# Altium project 2_Smoke_detector.PrjPcb (part 2 of 6)
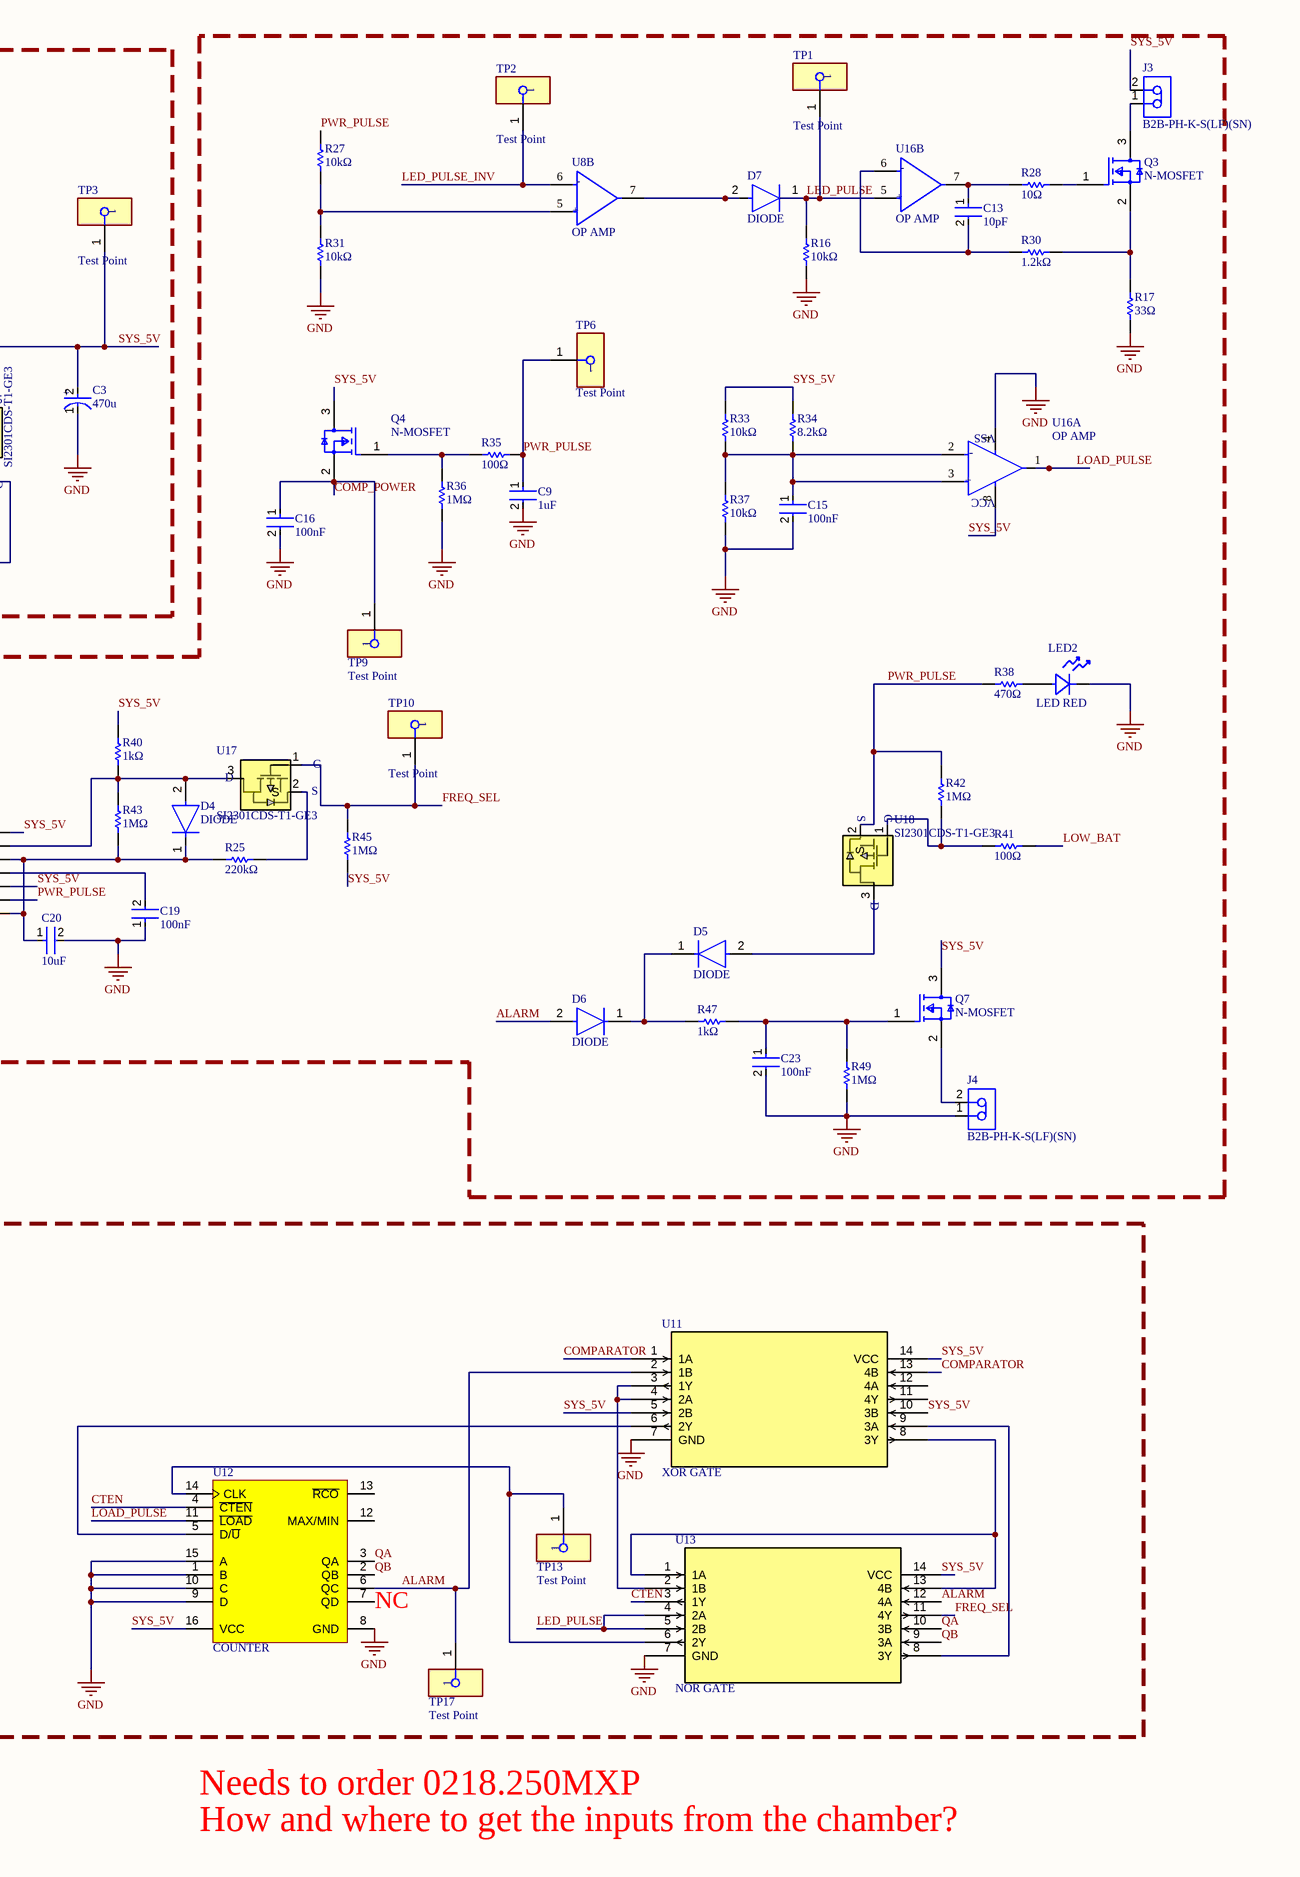
[diagram p2: 2_Smoke_detector.SchDoc, right]

## Sheet 2_Smoke_detector.SchDoc (continued)
### Library data of the parts
C1 = EEEFT1C101AR: CAP ALUM 100uF 20% 16V SMD; Life (Hours): 2000Hour; Ripple Current: 240mA; Leakage Current: 16uA; Lead Diameter: 0.65mm; ESR (Equivalent Series Resistance): 360mR; Capacitance: 100uF; Voltage Rating: 16V; Lead Pitch: 1.5mm; RoHS Compliant: Yes; Mount: Surface Mount; Tolerance: 20%; Contact Plating: Tin; Length: 5.8mm; Voltage: 16V; REACH SVHC: No SVHC; Max Operating Temperature: 105°C; Series: FT; Min Operating Temperature: -55°C; Diameter: 5mm; Case/Package: Radial; Radiation Hardening: No; Height - Seated (Max): 0.24inch; Construction: Cylindrical; Packaging: Tape and Reel; Voltage Rating (DC): 16V; Termination: SMD/SMT; Package Quantity: 1000; Ripple Current (AC): 240mA; Height: 5.8mm; LCSC Part Number: C336792
C2 C8 = CL21B104KBCNNNC: CAP CER 0.1uF 50V X7R 0805; Tolerance: 10%; Material: Ceramic; Capacitance: 100nF; Depth: 1.25mm; Height: 0.85mm; Width: 0.049inch; Case Code (Metric): 2012; Case Code (Imperial): 0805; Thickness: 0.037inch; Min Operating Temperature: -55°C; Contact Plating: Tin; Length: 2mm; Mount: Surface Mount; Voltage Rating (DC): 50V; Lead Free: Lead Free; Dielectric: X7R; Radiation Hardening: No; Voltage Rating: 50V; Case/Package: 0805; Packaging: Tape and Reel; Max Operating Temperature: 125°C; Voltage: 50V; LCSC Part Number: C1711
C3 = EEEFK1A471P: CAP ALUM 470uF ±20% 10V SMD; Manufacturer: Panasonic; Manufacturer Lifecycle Status: ACTIVE; Part Series: FK; Value: 470µF; Dielectric Material: Aluminium; Dissipation Factor: 19%; ESR (Equivalent Series Resistance): 160mΩ; Leakage Current: 47µA; Life (Hours): 2000hours; Ripple Current: 600mA; Supplier: Avnet; Supplier Part Number: EEE-FK1A471P; Manufacturer Part Number: EEEFK1A471P; RoHS: Compliant; Category: Aluminum Electrolytic Capacitors; Stock: 4000; Pricing: 500=0.28647, 1000=0.27558, 2000=0.26534, 4000=0.25696, 8000=0.24826 (USD); Case/Package: 3333; Country of Origin: Japan, Malaysia; Diameter: 8mm; Export Control Classification Number (ECCN) Code: EAR99; Height: 10.2mm; Height - Seated (Max): 10.2108mm; Harmonized Tariff Schedule (HTS) Code: 8532.22.00.20; Impedance: 160mΩ; Introduction Date: 2004-08-25; Lead Free: Lead Free; Length: 10.2mm; Lifecycle Status: Production; Max Operating Temperature: 105°C; Min Operating Temperature: -55°C; Mounting Technology: Surface Mount; Pins: 2; Number of Terminals: 2; Packaging: Cut Tape; Radiation Hardening: No; Ratings: AEC-Q200; REACH SVHC: Unaffected; Ripple Current (AC): 600mA; Schedule B: 8532220020, 8532220020|8532220020|8532220020|8532220020|8532220020; Termination: SMD/SMT; Tolerance: 20%; Voltage: 10V; Voltage Rating: 10V; Voltage Rating (AC): 10V; Voltage Rating (DC): 10V; Width: 8.3mm; ComponentLink1URL: https://datasheet.octopart.com:443/EEEFK1A471P-Panasonic-datasheet-169278531.pdf?src-supplier=IHS; ComponentLink1Description: https://datasheet.octopart.com:443/EEEFK1A471P-Panasonic-datasheet-169278531.pdf?src-supplier=IHS; ComponentLink2URL: https://datasheet.octopart.com:443/EEEFK1A471P-Panasonic-datasheet-62287436.pdf?src-supplier=Future+Electronics; ComponentLink2Description: https://datasheet.octopart.com:443/EEEFK1A471P-Panasonic-datasheet-62287436.pdf?src-supplier=Future+Electronics; ComponentLink3URL: https://datasheet.octopart.com:443/EEEFK1A471P-Panasonic-datasheet-8854493.pdf?src-supplier=Future+Electronics; ComponentLink3Description: https://datasheet.octopart.com:443/EEEFK1A471P-Panasonic-datasheet-8854493.pdf?src-supplier=Future+Electronics; ComponentLink4URL: https://datasheet.octopart.com:443/EEEFK1A471P-Panasonic-datasheet-8711795.pdf?src-supplier=Future+Electronics; ComponentLink4Description: https://datasheet.octopart.com:443/EEEFK1A471P-Panasonic-datasheet-8711795.pdf?src-supplier=Future+Electronics; ComponentLink5URL: https://datasheet.octopart.com:443/EEEFK1A471P-Panasonic-datasheet-5313801.pdf?src-supplier=Future+Electronics; ComponentLink5Description: https://datasheet.octopart.com:443/EEEFK1A471P-Panasonic-datasheet-5313801.pdf?src-supplier=Future+Electronics; ComponentLink6URL: https://datasheet.octopart.com:443/EEEFK1A471P-Panasonic-datasheet-61627622.pdf?src-supplier=Newark; ComponentLink6Description: https://datasheet.octopart.com:443/EEEFK1A471P-Panasonic-datasheet-61627622.pdf?src-supplier=Newark; ComponentLink7URL: https://datasheet.octopart.com:443/EEEFK1A471P-Panasonic-datasheet-8161.pdf?src-supplier=Newark; ComponentLink7Description: https://datasheet.octopart.com:443/EEEFK1A471P-Panasonic-datasheet-8161.pdf?src-supplier=Newark; ComponentLink8URL: https://datasheet.octopart.com:443/EEEFK1A471P-Panasonic-datasheet-8852369.pdf?src-supplier=Newark; ComponentLink8Description: https://datasheet.octopart.com:443/EEEFK1A471P-Panasonic-datasheet-8852369.pdf?src-supplier=Newark; ComponentLink9URL: https://datasheet.octopart.com:443/EEEFK1A471P-Panasonic-datasheet-8712906.pdf?src-supplier=Newark; ComponentLink9Description: https://datasheet.octopart.com:443/EEEFK1A471P-Panasonic-datasheet-8712906.pdf?src-supplier=Newark; ComponentLink10URL: https://datasheet.octopart.com:443/EEEFK1A471P-Panasonic-datasheet-13278598.pdf?src-supplier=Newark; ComponentLink10Description: https://datasheet.octopart.com:443/EEEFK1A471P-Panasonic-datasheet-13278598.pdf?src-supplier=Newark; ComponentLink11URL: https://datasheet.octopart.com:443/EEE-FK1A471P-Panasonic-datasheet-159140467.pdf?src-supplier=Newark; ComponentLink11Description: https://datasheet.octopart.com:443/EEE-FK1A471P-Panasonic-datasheet-159140467.pdf?src-supplier=Newark; ComponentLink12URL: https://datasheet.octopart.com:443/EEE-FK1A471P-Panasonic-datasheet-22087609.pdf?src-supplier=Newark; ComponentLink12Description: https://datasheet.octopart.com:443/EEE-FK1A471P-Panasonic-datasheet-22087609.pdf?src-supplier=Newark; ComponentLink13URL: https://datasheet.octopart.com:443/EEE-FK1A471P-Panasonic-datasheet-150469824.pdf?src-supplier=JRH+Electronics; ComponentLink13Description: https://datasheet.octopart.com:443/EEE-FK1A471P-Panasonic-datasheet-150469824.pdf?src-supplier=JRH+Electronics; ComponentLink14URL: https://datasheet.octopart.com:443/EEEFK1A471P-Panasonic-datasheet-13266987.pdf?src-supplier=RS+(Formerly+Allied+Electronics); ComponentLink14Description: https://datasheet.octopart.com:443/EEEFK1A471P-Panasonic-datasheet-13266987.pdf?src-supplier=RS+(Formerly+Allied+Electronics); ComponentLink15URL: https://datasheet.octopart.com:443/EEE-FK1A471P-Panasonic-datasheet-11546739.pdf?src-supplier=Electro+Sonic; ComponentLink15Description: https://datasheet.octopart.com:443/EEE-FK1A471P-Panasonic-datasheet-11546739.pdf?src-supplier=Electro+Sonic; ComponentLink16URL: https://sigma.octopart.com:443/150570760/technical_drawing/Panasonic-EEEFK1A471P.pdf?src-supplier=Panasonic+SCT; ComponentLink16Description: https://sigma.octopart.com:443/150570760/technical_drawing/Panasonic-EEEFK1A471P.pdf?src-supplier=Panasonic+SCT; ComponentLink17URL: https://datasheet.octopart.com:443/EEEFK1A471P-Panasonic-datasheet-136531309.pdf?src-supplier=TME; ComponentLink17Description: https://datasheet.octopart.com:443/EEEFK1A471P-Panasonic-datasheet-136531309.pdf?src-supplier=TME; ComponentLink18URL: https://datasheet.octopart.com:443/EEEFK1A471P-Panasonic-datasheet-136348055.pdf?src-supplier=TME; ComponentLink18Description: https://datasheet.octopart.com:443/EEEFK1A471P-Panasonic-datasheet-136348055.pdf?src-supplier=TME; ComponentLink19URL: https://datasheet.octopart.com:443/EEEFK1A471P-Panasonic-datasheet-7555708.pdf?src-supplier=Farnell; ComponentLink19Description: https://datasheet.octopart.com:443/EEEFK1A471P-Panasonic-datasheet-7555708.pdf?src-supplier=Farnell; ComponentLink20URL: https://datasheet.octopart.com:443/EEEFK1A471P-Panasonic-datasheet-5318435.pdf?src-supplier=Farnell; ComponentLink20Description: https://datasheet.octopart.com:443/EEEFK1A471P-Panasonic-datasheet-5318435.pdf?src-supplier=Farnell; ComponentLink21URL: https://datasheet.octopart.com:443/EEEFK1A471P-Panasonic-datasheet-5316599.pdf?src-supplier=Farnell; ComponentLink21Description: https://datasheet.octopart.com:443/EEEFK1A471P-Panasonic-datasheet-5316599.pdf?src-supplier=Farnell; ComponentLink22URL: https://datasheet.octopart.com:443/EEEFK1A471P-Panasonic-datasheet-5390910.pdf?src-supplier=Farnell; ComponentLink22Description: https://datasheet.octopart.com:443/EEEFK1A471P-Panasonic-datasheet-5390910.pdf?src-supplier=Farnell; ComponentLink23URL: https://datasheet.octopart.com:443/EEEFK1A471P-Panasonic-datasheet-7550061.pdf?src-supplier=Farnell; ComponentLink23Description: https://datasheet.octopart.com:443/EEEFK1A471P-Panasonic-datasheet-7550061.pdf?src-supplier=Farnell; ComponentLink24URL: https://datasheet.octopart.com:443/EEEFK1A471P-Panasonic-datasheet-1770.pdf?src-supplier=Farnell; ComponentLink24Description: https://datasheet.octopart.com:443/EEEFK1A471P-Panasonic-datasheet-1770.pdf?src-supplier=Farnell; ComponentLink25URL: https://datasheet.octopart.com:443/EEEFK1A471P-Panasonic-datasheet-1290.pdf?src-supplier=Farnell; ComponentLink25Description: https://datasheet.octopart.com:443/EEEFK1A471P-Panasonic-datasheet-1290.pdf?src-supplier=Farnell; ComponentLink26URL: https://datasheet.octopart.com:443/EEEFK1A471P-Panasonic-datasheet-2601.pdf?src-supplier=Farnell; ComponentLink26Description: https://datasheet.octopart.com:443/EEEFK1A471P-Panasonic-datasheet-2601.pdf?src-supplier=Farnell; ComponentLink27URL: https://datasheet.octopart.com:443/EEEFK1A471P-Panasonic-datasheet-122249.pdf?src-supplier=Farnell; ComponentLink27Description: https://datasheet.octopart.com:443/EEEFK1A471P-Panasonic-datasheet-122249.pdf?src-supplier=Farnell; ComponentLink28URL: https://datasheet.octopart.com:443/EEEFK1A471P-Panasonic-datasheet-4056.pdf?src-supplier=Farnell; ComponentLink28Description: https://datasheet.octopart.com:443/EEEFK1A471P-Panasonic-datasheet-4056.pdf?src-supplier=Farnell; LCSC Part Number: C178530
C4 = CC0805KRX7R6BB224: CAP CER 0.22uF 10V X7R 0805; Manufacturer: Yageo Group; Manufacturer Package Identifier: CC0805-0.85; Value: 220nF; Dielectric Material: Ceramic; Dissipation Factor: 5%; Insulation Resistance: 10GΩ; Tolerance: 10%; Supplier: DigiKey; Supplier Part Number: 311-4309-1-ND; Manufacturer Part Number: CC0805KRX7R6BB224; RoHS: Compliant; Category: Ceramic Capacitors; Stock: 33422; Pricing: 1=0.19, 10=0.109, 50=0.0768, 100=0.0669, 500=0.05016 (USD); Case/Package: 0805; Case Code (Imperial): 0805; Case Code (Metric): 2012; China RoHS: Compliant; Composition: Ceramic; Country of Origin: Mainland China, Taiwan; Depth: 1.25mm; Dielectric: X7R; Export Control Classification Number (ECCN) Code: EAR99; Halogen Free: Halogen Free; Height: 850µm; Harmonized Tariff Schedule (HTS) Code: 8532.24.00.20; Introduction Date: 2011-01-31; Lead Free: Lead Free; Length: 2mm; Lifecycle Status: Production; Material: Ceramic; Max Operating Temperature: 125°C; Min Operating Temperature: -55°C; Mounting Technology: Surface Mount; Number of Terminals: 2; Packaging: Tape and Reel; REACH SVHC: Unaffected; Termination: SMD/SMT; Thickness: 939.8µm; Voltage Rating: 10V; Voltage Rating (DC): 10V; Weight: 5.499807mg; Width: 1.25mm; ComponentLink1URL: https://datasheet.octopart.com:443/CC0805KRX7R6BB224-Yageo-datasheet-177165144.pdf?src-supplier=IHS; ComponentLink1Description: https://datasheet.octopart.com:443/CC0805KRX7R6BB224-Yageo-datasheet-177165144.pdf?src-supplier=IHS; ComponentLink2URL: https://datasheet.octopart.com:443/CC0805KRX7R6BB224-Yageo-datasheet-78855689.pdf?src-supplier=Upverter; ComponentLink2Description: https://datasheet.octopart.com:443/CC0805KRX7R6BB224-Yageo-datasheet-78855689.pdf?src-supplier=Upverter; ComponentLink3URL: https://datasheet.octopart.com/CC0805KRX7R6BB224-Yageo-datasheet-10883670.pdf; ComponentLink3Description: https://datasheet.octopart.com/CC0805KRX7R6BB224-Yageo-datasheet-10883670.pdf; ComponentLink4URL: https://datasheet.octopart.com:443/CC0805KRX7R6BB224-Yageo-Group-datasheet-184163374.pdf?src-supplier=LCSC; ComponentLink4Description: https://datasheet.octopart.com:443/CC0805KRX7R6BB224-Yageo-Group-datasheet-184163374.pdf?src-supplier=LCSC; ComponentLink5URL: https://datasheet.octopart.com:443/CC0805KRX7R6BB224-Yageo-datasheet-166511530.pdf?src-supplier=Future+Electronics; ComponentLink5Description: https://datasheet.octopart.com:443/CC0805KRX7R6BB224-Yageo-datasheet-166511530.pdf?src-supplier=Future+Electronics; ComponentLink6URL: https://datasheet.octopart.com:443/CC0805KRX7R6BB224-Yageo-datasheet-137700082.pdf?src-supplier=Future+Electronics; ComponentLink6Description: https://datasheet.octopart.com:443/CC0805KRX7R6BB224-Yageo-datasheet-137700082.pdf?src-supplier=Future+Electronics; ComponentLink7URL: https://datasheet.octopart.com:443/CC0805KRX7R6BB224-Yageo-datasheet-137700084.pdf?src-supplier=Future+Electronics; ComponentLink7Description: https://datasheet.octopart.com:443/CC0805KRX7R6BB224-Yageo-datasheet-137700084.pdf?src-supplier=Future+Electronics; ComponentLink8URL: https://datasheet.octopart.com:443/CC0805KRX7R6BB224-Yageo-datasheet-27626582.pdf?src-supplier=Future+Electronics; ComponentLink8Description: https://datasheet.octopart.com:443/CC0805KRX7R6BB224-Yageo-datasheet-27626582.pdf?src-supplier=Future+Electronics; ComponentLink9URL: https://datasheet.octopart.com:443/CC0805KRX7R6BB224-Yageo-datasheet-15895757.pdf?src-supplier=Future+Electronics; ComponentLink9Description: https://datasheet.octopart.com:443/CC0805KRX7R6BB224-Yageo-datasheet-15895757.pdf?src-supplier=Future+Electronics; ComponentLink10URL: https://datasheet.octopart.com:443/CC0805KRX7R6BB224-Yageo-datasheet-12526321.pdf?src-supplier=Future+Electronics; ComponentLink10Description: https://datasheet.octopart.com:443/CC0805KRX7R6BB224-Yageo-datasheet-12526321.pdf?src-supplier=Future+Electronics; ComponentLink11URL: https://datasheet.octopart.com:443/CC0805KRX7R6BB224-Yageo-Group-datasheet-165992755.pdf?src-supplier=ODG+(Origin+Data+Global); ComponentLink11Description: https://datasheet.octopart.com:443/CC0805KRX7R6BB224-Yageo-Group-datasheet-165992755.pdf?src-supplier=ODG+(Origin+Data+Global); ComponentLink12URL: http://sigma.octopart.com:80/conflict_mineral_statement/Yageo-company-3.pdf?src-supplier=Compliance+Statements; ComponentLink12Description: http://sigma.octopart.com:80/conflict_mineral_statement/Yageo-company-3.pdf?src-supplier=Compliance+Statements; ComponentLink13URL: http://sigma.octopart.com:80/rohs_statement/Yageo-company-2.pdf?src-supplier=Compliance+Statements; ComponentLink13Description: http://sigma.octopart.com:80/rohs_statement/Yageo-company-2.pdf?src-supplier=Compliance+Statements; LCSC Part Number: C520019
C5 C6 = GRM21BR61A476ME15L: CAP CER 47uF 10V X5R 0805; Manufacturer: Murata; Manufacturer Lifecycle Status: IN PRODUCTION; Value: 47µF; Dielectric Material: Ceramic; Dissipation Factor: 0.035%; Tolerance: 20%; Supplier: Future Electronics; Supplier Part Number: GRM21BR61A476ME15L; Manufacturer Part Number: GRM21BR61A476ME15L; RoHS: Compliant; Category: Ceramic Capacitors; Stock: 548000; Pricing: 3000=0.715 (USD); Case/Package: 0805; Case Code (Imperial): 0805; Case Code (Metric): 2012; Country of Origin: Philippines; Depth: 1.25mm; Dielectric: X5R; Export Control Classification Number (ECCN) Code: EAR99; Height: 1.25mm; Harmonized Tariff Schedule (HTS) Code: 8532.24.00.20; Introduction Date: 2013-11-20; Lead Free: Lead Free; Length: 2mm; Lifecycle Status: Production; Material: Ceramic; Max Operating Temperature: 85°C; Min Operating Temperature: -55°C; Mounting Technology: Surface Mount; Number of Terminals: 2; Packaging: Cut Tape; REACH SVHC: Unaffected; Schedule B: 8532240020, 8532240020|8532240020, 8532240020|8532240020|8532240020, 8532240020|8532240020|8532240020|8532240020; Termination: SMD/SMT; Thickness: 1.25mm; Voltage: 10V; Voltage Rating: 10V; Voltage Rating (DC): 10V; Width: 1.25mm; ComponentLink1URL: https://datasheet.octopart.com:443/GRM21BR61A476ME15L-Murata-datasheet-22122223.pdf?src-supplier=Upverter; ComponentLink1Description: https://datasheet.octopart.com:443/GRM21BR61A476ME15L-Murata-datasheet-22122223.pdf?src-supplier=Upverter; ComponentLink2URL: https://datasheet.octopart.com:443/GRM21BR61A476ME15L-Murata-datasheet-66077109.pdf?src-supplier=element14+APAC; ComponentLink2Description: https://datasheet.octopart.com:443/GRM21BR61A476ME15L-Murata-datasheet-66077109.pdf?src-supplier=element14+APAC; ComponentLink3URL: https://datasheet.octopart.com:443/GRM21BR61A476ME15L-Murata-datasheet-141278181.pdf?src-supplier=Geoflip; ComponentLink3Description: https://datasheet.octopart.com:443/GRM21BR61A476ME15L-Murata-datasheet-141278181.pdf?src-supplier=Geoflip; ComponentLink4URL: https://datasheet.octopart.com:443/GRM21BR61A476ME15L-Murata-datasheet-165579666.pdf?src-supplier=TME; ComponentLink4Description: https://datasheet.octopart.com:443/GRM21BR61A476ME15L-Murata-datasheet-165579666.pdf?src-supplier=TME; ComponentLink5URL: https://datasheet.octopart.com:443/GRM21BR61A476ME15L-Murata-datasheet-59876780.pdf?src-supplier=TME; ComponentLink5Description: https://datasheet.octopart.com:443/GRM21BR61A476ME15L-Murata-datasheet-59876780.pdf?src-supplier=TME; ComponentLink6URL: https://datasheet.octopart.com:443/GRM21BR61A476ME15L-Murata-datasheet-140707527.pdf?src-supplier=Ciiva; ComponentLink6Description: https://datasheet.octopart.com:443/GRM21BR61A476ME15L-Murata-datasheet-140707527.pdf?src-supplier=Ciiva; ComponentLink7URL: https://datasheet.octopart.com:443/GRM21BR61A476ME15L-Murata-datasheet-138744839.pdf?src-supplier=Ciiva; ComponentLink7Description: https://datasheet.octopart.com:443/GRM21BR61A476ME15L-Murata-datasheet-138744839.pdf?src-supplier=Ciiva; ComponentLink8URL: https://datasheet.octopart.com/GRM21BR61A476ME15L-Murata-datasheet-12515295.pdf; ComponentLink8Description: https://datasheet.octopart.com/GRM21BR61A476ME15L-Murata-datasheet-12515295.pdf; ComponentLink9URL: https://datasheet.octopart.com/GRM21BR61A476ME15L-Murata-datasheet-12510076.pdf; ComponentLink9Description: https://datasheet.octopart.com/GRM21BR61A476ME15L-Murata-datasheet-12510076.pdf; ComponentLink10URL: https://datasheet.octopart.com/GRM21BR61A476ME15L-Murata-datasheet-11978611.pdf; ComponentLink10Description: https://datasheet.octopart.com/GRM21BR61A476ME15L-Murata-datasheet-11978611.pdf; ComponentLink11URL: https://datasheet.octopart.com/GRM21BR61A476ME15L-Murata-datasheet-10025737.pdf; ComponentLink11Description: https://datasheet.octopart.com/GRM21BR61A476ME15L-Murata-datasheet-10025737.pdf; ComponentLink12URL: https://datasheet.octopart.com/GRM21BR61A476ME15L-Murata-datasheet-8819587.pdf; ComponentLink12Description: https://datasheet.octopart.com/GRM21BR61A476ME15L-Murata-datasheet-8819587.pdf; ComponentLink13URL: http://sigma.octopart.com:80/reach_statement/Murata-company-16.pdf?src-supplier=Compliance+Statements; ComponentLink13Description: http://sigma.octopart.com:80/reach_statement/Murata-company-16.pdf?src-supplier=Compliance+Statements; LCSC Part Number: C124129
C7 = CC0805CRNPO9BN5R0: CAP CER 5pF 50V NP0 0805; Manufacturer: Yageo Group; Dielectric: C0G; Dielectric Material: Ceramic; Supplier: Future Electronics; Supplier Part Number: CC0805CRNPO9BN5R0; Manufacturer Part Number: CC0805CRNPO9BN5R0; RoHS: Compliant; Category: Ceramic Capacitors; Stock: 16000; Pricing: 4000=0.0639, 8000=0.0628, 12000=0.0622, 16000=0.0617, 20000=0.0604 (USD); Value: 5pF; Case/Package: 0805; Case Code (Imperial): 0805; Case Code (Metric): 2012; China RoHS: Compliant; Composition: Ceramic; Depth: 1.25mm; Halogen Free: Halogen Free; Lead Free: Lead Free; Length: 2mm; Lifecycle Status: Production; Max Operating Temperature: 125°C; Min Operating Temperature: -55°C; Mounting Technology: Surface Mount; Number of Terminals: 2; Packaging: Tape and Reel; Radiation Hardening: No; REACH SVHC: Unaffected; Termination: SMD/SMT; Thickness: 711.2µm; Voltage Rating: 50V; Voltage Rating (DC): 50V; Weight: 5.499807mg; Width: 1.2446mm; ComponentLink1URL: https://datasheet.octopart.com:443/CC0805CRNPO9BN5R0-Yageo-datasheet-137875056.pdf?src-supplier=IHS; ComponentLink1Description: https://datasheet.octopart.com:443/CC0805CRNPO9BN5R0-Yageo-datasheet-137875056.pdf?src-supplier=IHS; ComponentLink2URL: https://datasheet.octopart.com:443/CC0805CRNPO9BN5R0-Yageo-Group-datasheet-192360829.pdf?src-supplier=Future+Electronics; ComponentLink2Description: https://datasheet.octopart.com:443/CC0805CRNPO9BN5R0-Yageo-Group-datasheet-192360829.pdf?src-supplier=Future+Electronics; ComponentLink3URL: https://datasheet.octopart.com:443/CC0805CRNPO9BN5R0-Yageo-datasheet-137700082.pdf?src-supplier=Future+Electronics; ComponentLink3Description: https://datasheet.octopart.com:443/CC0805CRNPO9BN5R0-Yageo-datasheet-137700082.pdf?src-supplier=Future+Electronics; ComponentLink4URL: https://datasheet.octopart.com:443/CC0805CRNPO9BN5R0-Yageo-datasheet-78855684.pdf?src-supplier=Future+Electronics; ComponentLink4Description: https://datasheet.octopart.com:443/CC0805CRNPO9BN5R0-Yageo-datasheet-78855684.pdf?src-supplier=Future+Electronics; ComponentLink5URL: https://datasheet.octopart.com:443/CC0805CRNPO9BN5R0-Yageo-datasheet-24578986.pdf?src-supplier=Future+Electronics; ComponentLink5Description: https://datasheet.octopart.com:443/CC0805CRNPO9BN5R0-Yageo-datasheet-24578986.pdf?src-supplier=Future+Electronics; ComponentLink6URL: https://datasheet.octopart.com:443/CC0805CRNPO9BN5R0-Yageo-datasheet-16730043.pdf?src-supplier=Future+Electronics; ComponentLink6Description: https://datasheet.octopart.com:443/CC0805CRNPO9BN5R0-Yageo-datasheet-16730043.pdf?src-supplier=Future+Electronics; ComponentLink7URL: https://datasheet.octopart.com:443/CC0805CRNPO9BN5R0-Yageo-datasheet-12589826.pdf?src-supplier=Future+Electronics; ComponentLink7Description: https://datasheet.octopart.com:443/CC0805CRNPO9BN5R0-Yageo-datasheet-12589826.pdf?src-supplier=Future+Electronics; ComponentLink8URL: https://datasheet.octopart.com:443/CC0805CRNPO9BN5R0-Yageo-datasheet-182878260.pdf?src-supplier=Farnell; ComponentLink8Description: https://datasheet.octopart.com:443/CC0805CRNPO9BN5R0-Yageo-datasheet-182878260.pdf?src-supplier=Farnell; ComponentLink9URL: https://datasheet.octopart.com:443/CC0805CRNPO9BN5R0-Yageo-datasheet-151948684.pdf?src-supplier=Newark; ComponentLink9Description: https://datasheet.octopart.com:443/CC0805CRNPO9BN5R0-Yageo-datasheet-151948684.pdf?src-supplier=Newark; ComponentLink10URL: https://datasheet.octopart.com:443/CC0805CRNPO9BN5R0-Yageo-datasheet-10406438.pdf?src-supplier=_legacy+Avnet; ComponentLink10Description: https://datasheet.octopart.com:443/CC0805CRNPO9BN5R0-Yageo-datasheet-10406438.pdf?src-supplier=_legacy+Avnet; ComponentLink11URL: http://sigma.octopart.com:80/conflict_mineral_statement/Yageo-company-3.pdf?src-supplier=Compliance+Statements; ComponentLink11Description: http://sigma.octopart.com:80/conflict_mineral_statement/Yageo-company-3.pdf?src-supplier=Compliance+Statements; ComponentLink12URL: http://sigma.octopart.com:80/rohs_statement/Yageo-company-2.pdf?src-supplier=Compliance+Statements; ComponentLink12Description: http://sigma.octopart.com:80/rohs_statement/Yageo-company-2.pdf?src-supplier=Compliance+Statements; LCSC Part Number: C519940
C9 C10 = CL21B105KBFNNNE: CAP CER 1uF 50V X7R 0805; Manufacturer: Samsung Electro-Mechanics; Value: 1µF; Dielectric Material: Ceramic; Tolerance: 10%; Supplier: Avnet; Supplier Part Number: CL21B105KBFNNNE; Manufacturer Part Number: CL21B105KBFNNNE; RoHS: Compliant; Category: Ceramic Capacitors; Pricing: 2000=0.01628 (USD); Case/Package: 0805; Case Code (Imperial): 0805; Case Code (Metric): 2012; China RoHS: Compliant; Country of Origin: Mainland China, Philippines, South Korea; Depth: 1.25mm; Dielectric: X7R; Export Control Classification Number (ECCN) Code: EAR99; Height: 1.35mm; Harmonized Tariff Schedule (HTS) Code: 8532.24.00.20; Introduction Date: 2010-07-30; Length: 2mm; Lifecycle Status: Production; Material: Ceramic; Max Operating Temperature: 125°C; Min Operating Temperature: -55°C; Mounting Technology: Surface Mount; Number of Terminals: 2; Radiation Hardening: No; REACH SVHC: Unaffected; Schedule B: 8532240020, 8532240020|8532240020, 8532240020|8532240020|8532240020, 8532240020|8532240020|8532240020|8532240020; Thickness: 1.3462mm; Voltage: 50V; Voltage Rating: 50V; Voltage Rating (DC): 50V; Width: 1.25mm; ComponentLink1URL: https://datasheet.octopart.com:443/CL21B105KBFNNNE-Samsung-Electro-Mechanics-datasheet-136482495.pdf?src-supplier=IHS; ComponentLink1Description: https://datasheet.octopart.com:443/CL21B105KBFNNNE-Samsung-Electro-Mechanics-datasheet-136482495.pdf?src-supplier=IHS; ComponentLink2URL: https://datasheet.octopart.com:443/CL21B105KBFNNNE-Samsung-Electro-Mechanics-datasheet-11733377.pdf?src-supplier=Future+Electronics; ComponentLink2Description: https://datasheet.octopart.com:443/CL21B105KBFNNNE-Samsung-Electro-Mechanics-datasheet-11733377.pdf?src-supplier=Future+Electronics; ComponentLink3URL: https://datasheet.octopart.com:443/CL21B105KBFNNNE-Samsung-Electro-Mechanics-datasheet-116891038.pdf?src-supplier=Future+Electronics; ComponentLink3Description: https://datasheet.octopart.com:443/CL21B105KBFNNNE-Samsung-Electro-Mechanics-datasheet-116891038.pdf?src-supplier=Future+Electronics; ComponentLink4URL: https://datasheet.octopart.com:443/CL21B105KBFNNNE-Samsung-Electro-Mechanics-datasheet-81462183.pdf?src-supplier=Future+Electronics; ComponentLink4Description: https://datasheet.octopart.com:443/CL21B105KBFNNNE-Samsung-Electro-Mechanics-datasheet-81462183.pdf?src-supplier=Future+Electronics; ComponentLink5URL: https://datasheet.octopart.com:443/CL21B105KBFNNNE-Samsung-datasheet-48647582.pdf?src-supplier=Future+Electronics; ComponentLink5Description: https://datasheet.octopart.com:443/CL21B105KBFNNNE-Samsung-datasheet-48647582.pdf?src-supplier=Future+Electronics; ComponentLink6URL: https://datasheet.octopart.com:443/CL21B105KBFNNNE-Samsung-datasheet-8326294.pdf?src-supplier=Future+Electronics; ComponentLink6Description: https://datasheet.octopart.com:443/CL21B105KBFNNNE-Samsung-datasheet-8326294.pdf?src-supplier=Future+Electronics; ComponentLink7URL: https://datasheet.octopart.com:443/CL21B105KBFNNNE-Samsung-Electro-Mechanics-datasheet-149045959.pdf?src-supplier=Future+Electronics; ComponentLink7Description: https://datasheet.octopart.com:443/CL21B105KBFNNNE-Samsung-Electro-Mechanics-datasheet-149045959.pdf?src-supplier=Future+Electronics; ComponentLink8URL: https://datasheet.octopart.com/CL21B105KBFNNNE-Samsung-Electro-Mechanics-datasheet-97040617.pdf; ComponentLink8Description: https://datasheet.octopart.com/CL21B105KBFNNNE-Samsung-Electro-Mechanics-datasheet-97040617.pdf; ComponentLink9URL: https://datasheet.octopart.com/CL21B105KBFNNNE-Samsung-Electro-Mechanics-datasheet-8324245.pdf; ComponentLink9Description: https://datasheet.octopart.com/CL21B105KBFNNNE-Samsung-Electro-Mechanics-datasheet-8324245.pdf; ComponentLink10URL: https://datasheet.octopart.com/General-Multilayer-Ceramic-Capacitors-Samsung-datasheet-family-111.pdf; ComponentLink10Description: https://datasheet.octopart.com/General-Multilayer-Ceramic-Capacitors-Samsung-datasheet-family-111.pdf; ComponentLink11URL: https://datasheet.octopart.com:443/CL21B105KBFNNNE-Samsung-datasheet-59220082.pdf?src-supplier=TME; ComponentLink11Description: https://datasheet.octopart.com:443/CL21B105KBFNNNE-Samsung-datasheet-59220082.pdf?src-supplier=TME; ComponentLink12URL: http://sigma.octopart.com:80/rohs_certificate/General-Multilayer-Ceramic-Capacitors-Samsung-family-110.pdf?src-supplier=Compliance+Statements; ComponentLink12Description: http://sigma.octopart.com:80/rohs_certificate/General-Multilayer-Ceramic-Capacitors-Samsung-family-110.pdf?src-supplier=Compliance+Statements; ComponentLink13URL: http://sigma.octopart.com:80/rohs_statement/General-Multilayer-Ceramic-Capacitors-Samsung-family-132.pdf?src-supplier=Compliance+Statements; ComponentLink13Description: http://sigma.octopart.com:80/rohs_statement/General-Multilayer-Ceramic-Capacitors-Samsung-family-132.pdf?src-supplier=Compliance+Statements; ComponentLink14URL: http://sigma.octopart.com:80/reach_statement/General-Multilayer-Ceramic-Capacitors-Samsung-family-133.pdf?src-supplier=Compliance+Statements; ComponentLink14Description: http://sigma.octopart.com:80/reach_statement/General-Multilayer-Ceramic-Capacitors-Samsung-family-133.pdf?src-supplier=Compliance+Statements; LCSC Part Number: C28323
C11 = CL21B102KBCNNNC: CAP CER 1nF 50V X7R 0805; Manufacturer: Samsung Electro-Mechanics; Dielectric Material: Ceramic; Tolerance: 10%; Supplier: Avnet; Supplier Part Number: CL21B102KBCNNNC; Manufacturer Part Number: CL21B102KBCNNNC; RoHS: Compliant; Category: Ceramic Capacitors; Stock: 428000; Pricing: 4000=0.0102 (USD); Value: 1nF; Case/Package: 0805; Case Code (Imperial): 0805; Case Code (Metric): 2012; China RoHS: Compliant; Country of Origin: Mainland China, Philippines, South Korea; Depth: 1.25mm; Dielectric: X7R; Export Control Classification Number (ECCN) Code: EAR99; Height: 850µm; Harmonized Tariff Schedule (HTS) Code: 8532.24.00.20; Introduction Date: 2010-07-30; Lead Free: Lead Free; Length: 2mm; Lifecycle Status: Production; Material: Ceramic; Max Operating Temperature: 125°C; Min Operating Temperature: -55°C; Mounting Technology: Surface Mount; Number of Terminals: 2; Radiation Hardening: No; REACH SVHC: Unaffected; Schedule B: 8532240020, 8532240020|8532240020|8532240020|8532240020|8532240020|8532240020|8532240020|8532240020|8532240020|8532240020|8532240020|8532240020|8532240020|8532240020|8532240020|8532240020|8532240020|8532240020|8532240020|8532240020|8532240020|8532240020|8532240020|85; Thickness: 939.8µm; Voltage Rating: 50V; Voltage Rating (DC): 50V; Width: 1.25mm; ComponentLink1URL: https://datasheet.octopart.com:443/CL21B102KBCNNNC-Samsung-Electro-Mechanics-datasheet-136482475.pdf?src-supplier=IHS; ComponentLink1Description: https://datasheet.octopart.com:443/CL21B102KBCNNNC-Samsung-Electro-Mechanics-datasheet-136482475.pdf?src-supplier=IHS; ComponentLink2URL: https://datasheet.octopart.com:443/CL21B102KBCNNNC-Samsung-Electro-Mechanics-datasheet-116891019.pdf?src-supplier=Future+Electronics; ComponentLink2Description: https://datasheet.octopart.com:443/CL21B102KBCNNNC-Samsung-Electro-Mechanics-datasheet-116891019.pdf?src-supplier=Future+Electronics; ComponentLink3URL: https://datasheet.octopart.com:443/CL21B102KBCNNNC-Samsung-Electro-Mechanics-datasheet-81462161.pdf?src-supplier=Future+Electronics; ComponentLink3Description: https://datasheet.octopart.com:443/CL21B102KBCNNNC-Samsung-Electro-Mechanics-datasheet-81462161.pdf?src-supplier=Future+Electronics; ComponentLink4URL: https://datasheet.octopart.com:443/CL21B102KBCNNNC-Samsung-datasheet-31820677.pdf?src-supplier=Future+Electronics; ComponentLink4Description: https://datasheet.octopart.com:443/CL21B102KBCNNNC-Samsung-datasheet-31820677.pdf?src-supplier=Future+Electronics; ComponentLink5URL: https://datasheet.octopart.com:443/CL21B102KBCNNNC-Samsung-Electro-Mechanics-datasheet-149045903.pdf?src-supplier=Future+Electronics; ComponentLink5Description: https://datasheet.octopart.com:443/CL21B102KBCNNNC-Samsung-Electro-Mechanics-datasheet-149045903.pdf?src-supplier=Future+Electronics; ComponentLink6URL: https://datasheet.octopart.com:443/CL21B102KBCNNNC-Samsung-datasheet-37081328.pdf?src-supplier=Future+Electronics; ComponentLink6Description: https://datasheet.octopart.com:443/CL21B102KBCNNNC-Samsung-datasheet-37081328.pdf?src-supplier=Future+Electronics; ComponentLink7URL: https://datasheet.octopart.com/CL21B102KBCNNNC-Samsung-Electro-Mechanics-datasheet-97040617.pdf; ComponentLink7Description: https://datasheet.octopart.com/CL21B102KBCNNNC-Samsung-Electro-Mechanics-datasheet-97040617.pdf; ComponentLink8URL: https://datasheet.octopart.com/CL21B102KBCNNNC-Samsung-Electro-Mechanics-datasheet-8324245.pdf; ComponentLink8Description: https://datasheet.octopart.com/CL21B102KBCNNNC-Samsung-Electro-Mechanics-datasheet-8324245.pdf; ComponentLink9URL: https://datasheet.octopart.com/General-Multilayer-Ceramic-Capacitors-Samsung-datasheet-family-111.pdf; ComponentLink9Description: https://datasheet.octopart.com/General-Multilayer-Ceramic-Capacitors-Samsung-datasheet-family-111.pdf; ComponentLink10URL: http://sigma.octopart.com:80/rohs_certificate/General-Multilayer-Ceramic-Capacitors-Samsung-family-110.pdf?src-supplier=Compliance+Statements; ComponentLink10Description: http://sigma.octopart.com:80/rohs_certificate/General-Multilayer-Ceramic-Capacitors-Samsung-family-110.pdf?src-supplier=Compliance+Statements; ComponentLink11URL: http://sigma.octopart.com:80/rohs_statement/General-Multilayer-Ceramic-Capacitors-Samsung-family-132.pdf?src-supplier=Compliance+Statements; ComponentLink11Description: http://sigma.octopart.com:80/rohs_statement/General-Multilayer-Ceramic-Capacitors-Samsung-family-132.pdf?src-supplier=Compliance+Statements; ComponentLink12URL: http://sigma.octopart.com:80/reach_statement/General-Multilayer-Ceramic-Capacitors-Samsung-family-133.pdf?src-supplier=Compliance+Statements; ComponentLink12Description: http://sigma.octopart.com:80/reach_statement/General-Multilayer-Ceramic-Capacitors-Samsung-family-133.pdf?src-supplier=Compliance+Statements; LCSC Part Number: C46653
C12 C15 C16 C18 C19 C22 C23 = CC0805KRX7R9BB104: CAP CER 100nF 50V X7R 0805; Manufacturer: Yageo Group; Manufacturer Package Identifier: CC0805-0.85; Dielectric Material: Ceramic; Insulation Resistance: 100GΩ; Tolerance: 10%; Supplier: Future Electronics; Supplier Part Number: CC0805KRX7R9BB104; Manufacturer Part Number: CC0805KRX7R9BB104; RoHS: Compliant; Category: Ceramic Capacitors; Stock: 10784000; Pricing: 4000=0.0847, 8000=0.0834, 12000=0.0826, 20000=0.0816, 40000=0.0794 (USD); Value: 100nF; Case/Package: 0805; Case Code (Imperial): 0805; Case Code (Metric): 2012; China RoHS: Compliant; Country of Origin: Mainland China, Taiwan; Depth: 1.25mm; Dielectric: X7R; Export Control Classification Number (ECCN) Code: EAR99; Halogen Free: Halogen Free; Height: 850µm; Harmonized Tariff Schedule (HTS) Code: 8532.24.00.20; Introduction Date: 2003-01-27; Lead Free: Lead Free; Length: 2mm; Lifecycle Status: Production; Material: Ceramic; Max Operating Temperature: 125°C; Min Operating Temperature: -55°C; Mounting Technology: Surface Mount; Pins: 2; Number of Terminals: 2; Packaging: Cut Tape; Radiation Hardening: No; REACH SVHC: Unaffected; Schedule B: 8532240020, 8532240020|8532240020|8532240020|8532240020|8532240020|8532240020|8532240020|8532240020|8532240020|8532240020|8532240020|8532240020|8532240020|8532240020|8532240020|8532240020, 8532240020|8532240020|8532240020|8532240020|8532240020|8532240020|8532240020|8532240020|8532240020|8532240020|8532240020|8532240020|8532240020|8532240020|8532240020|8532240020|8532240020, 8532240020|8532240020|8532240020|8532240020|8532240020|8532240020|8532240020|8532240020|8532240020|8532240020|8532240020|8532240020|8532240020|8532240020|8532240020|8532240020|8532240020|8532240020; Termination: SMD/SMT; Thickness: 838.2µm; Voltage: 50V; Voltage Rating: 50V; Voltage Rating (DC): 50V; Width: 1.25mm; ComponentLink1URL: https://datasheet.octopart.com:443/CC0805KRX7R9BB104-Yageo-datasheet-177165144.pdf?src-supplier=IHS; ComponentLink1Description: https://datasheet.octopart.com:443/CC0805KRX7R9BB104-Yageo-datasheet-177165144.pdf?src-supplier=IHS; ComponentLink2URL: https://datasheet.octopart.com:443/CC0805KRX7R9BB104-Yageo-datasheet-78855689.pdf?src-supplier=Upverter; ComponentLink2Description: https://datasheet.octopart.com:443/CC0805KRX7R9BB104-Yageo-datasheet-78855689.pdf?src-supplier=Upverter; ComponentLink3URL: https://datasheet.octopart.com:443/CC0805KRX7R9BB104-Yageo-datasheet-68298032.pdf?src-supplier=Upverter; ComponentLink3Description: https://datasheet.octopart.com:443/CC0805KRX7R9BB104-Yageo-datasheet-68298032.pdf?src-supplier=Upverter; ComponentLink4URL: https://datasheet.octopart.com/CC0805KRX7R9BB104-Yageo-datasheet-10883670.pdf; ComponentLink4Description: https://datasheet.octopart.com/CC0805KRX7R9BB104-Yageo-datasheet-10883670.pdf; ComponentLink5URL: https://datasheet.octopart.com:443/CC0805KRX7R9BB104-Yageo-datasheet-62336348.pdf?src-supplier=Newark; ComponentLink5Description: https://datasheet.octopart.com:443/CC0805KRX7R9BB104-Yageo-datasheet-62336348.pdf?src-supplier=Newark; ComponentLink6URL: https://datasheet.octopart.com:443/CC0805KRX7R9BB104-Yageo-datasheet-181969852.pdf?src-supplier=Newark; ComponentLink6Description: https://datasheet.octopart.com:443/CC0805KRX7R9BB104-Yageo-datasheet-181969852.pdf?src-supplier=Newark; ComponentLink7URL: https://datasheet.octopart.com:443/CC0805KRX7R9BB104-Yageo-datasheet-181969851.pdf?src-supplier=Newark; ComponentLink7Description: https://datasheet.octopart.com:443/CC0805KRX7R9BB104-Yageo-datasheet-181969851.pdf?src-supplier=Newark; ComponentLink8URL: https://datasheet.octopart.com:443/CC0805KRX7R9BB104-Phycomp-datasheet-499490.pdf?src-supplier=Newark; ComponentLink8Description: https://datasheet.octopart.com:443/CC0805KRX7R9BB104-Phycomp-datasheet-499490.pdf?src-supplier=Newark; ComponentLink9URL: https://datasheet.octopart.com:443/CC0805KRX7R9BB104-Yageo-datasheet-147453679.pdf?src-supplier=element14+APAC; ComponentLink9Description: https://datasheet.octopart.com:443/CC0805KRX7R9BB104-Yageo-datasheet-147453679.pdf?src-supplier=element14+APAC; ComponentLink10URL: https://datasheet.octopart.com:443/CC0805KRX7R9BB104-Yageo-datasheet-151948686.pdf?src-supplier=Farnell; ComponentLink10Description: https://datasheet.octopart.com:443/CC0805KRX7R9BB104-Yageo-datasheet-151948686.pdf?src-supplier=Farnell; ComponentLink11URL: https://datasheet.octopart.com:443/CC0805KRX7R9BB104-Yageo-Group-datasheet-188689702.pdf?src-supplier=Farnell; ComponentLink11Description: https://datasheet.octopart.com:443/CC0805KRX7R9BB104-Yageo-Group-datasheet-188689702.pdf?src-supplier=Farnell; ComponentLink12URL: https://datasheet.octopart.com:443/CC0805KRX7R9BB104-Phycomp-datasheet-500777.pdf?src-supplier=Farnell; ComponentLink12Description: https://datasheet.octopart.com:443/CC0805KRX7R9BB104-Phycomp-datasheet-500777.pdf?src-supplier=Farnell; ComponentLink13URL: https://datasheet.octopart.com:443/CC0805KRX7R9BB104-Yageo-Group-datasheet-189192896.pdf?src-supplier=Future+Electronics; ComponentLink13Description: https://datasheet.octopart.com:443/CC0805KRX7R9BB104-Yageo-Group-datasheet-189192896.pdf?src-supplier=Future+Electronics; ComponentLink14URL: https://datasheet.octopart.com:443/CC0805KRX7R9BB104-Yageo-datasheet-166511530.pdf?src-supplier=Future+Electronics; ComponentLink14Description: https://datasheet.octopart.com:443/CC0805KRX7R9BB104-Yageo-datasheet-166511530.pdf?src-supplier=Future+Electronics; ComponentLink15URL: https://datasheet.octopart.com:443/CC0805KRX7R9BB104-Yageo-datasheet-137700082.pdf?src-supplier=Future+Electronics; ComponentLink15Description: https://datasheet.octopart.com:443/CC0805KRX7R9BB104-Yageo-datasheet-137700082.pdf?src-supplier=Future+Electronics; ComponentLink16URL: https://datasheet.octopart.com:443/CC0805KRX7R9BB104-Yageo-datasheet-137700084.pdf?src-supplier=Future+Electronics; ComponentLink16Description: https://datasheet.octopart.com:443/CC0805KRX7R9BB104-Yageo-datasheet-137700084.pdf?src-supplier=Future+Electronics; ComponentLink17URL: https://datasheet.octopart.com:443/CC0805KRX7R9BB104-Yageo-datasheet-82288757.pdf?src-supplier=Future+Electronics; ComponentLink17Description: https://datasheet.octopart.com:443/CC0805KRX7R9BB104-Yageo-datasheet-82288757.pdf?src-supplier=Future+Electronics; ComponentLink18URL: https://datasheet.octopart.com:443/CC0805KRX7R9BB104-Yageo-datasheet-62139192.pdf?src-supplier=Future+Electronics; ComponentLink18Description: https://datasheet.octopart.com:443/CC0805KRX7R9BB104-Yageo-datasheet-62139192.pdf?src-supplier=Future+Electronics; ComponentLink19URL: https://datasheet.octopart.com:443/CC0805KRX7R9BB104-Yageo-datasheet-27626582.pdf?src-supplier=Future+Electronics; ComponentLink19Description: https://datasheet.octopart.com:443/CC0805KRX7R9BB104-Yageo-datasheet-27626582.pdf?src-supplier=Future+Electronics; ComponentLink20URL: https://datasheet.octopart.com:443/CC0805KRX7R9BB104-Yageo-datasheet-15895757.pdf?src-supplier=Future+Electronics; ComponentLink20Description: https://datasheet.octopart.com:443/CC0805KRX7R9BB104-Yageo-datasheet-15895757.pdf?src-supplier=Future+Electronics; ComponentLink21URL: https://datasheet.octopart.com:443/CC0805KRX7R9BB104-Yageo-datasheet-12526321.pdf?src-supplier=Future+Electronics; ComponentLink21Description: https://datasheet.octopart.com:443/CC0805KRX7R9BB104-Yageo-datasheet-12526321.pdf?src-supplier=Future+Electronics; ComponentLink22URL: https://datasheet.octopart.com:443/CC0805KRX7R9BB104-Yageo-datasheet-8324192.pdf?src-supplier=Future+Electronics; ComponentLink22Description: https://datasheet.octopart.com:443/CC0805KRX7R9BB104-Yageo-datasheet-8324192.pdf?src-supplier=Future+Electronics; ComponentLink23URL: https://datasheet.octopart.com:443/CC0805KRX7R9BB104-Yageo-Group-datasheet-184163374.pdf?src-supplier=LCSC; ComponentLink23Description: https://datasheet.octopart.com:443/CC0805KRX7R9BB104-Yageo-Group-datasheet-184163374.pdf?src-supplier=LCSC; ComponentLink24URL: https://datasheet.octopart.com:443/CC0805KRX7R9BB104-Yageo-Group-datasheet-165992755.pdf?src-supplier=ODG+(Origin+Data+Global); ComponentLink24Description: https://datasheet.octopart.com:443/CC0805KRX7R9BB104-Yageo-Group-datasheet-165992755.pdf?src-supplier=ODG+(Origin+Data+Global); ComponentLink25URL: https://datasheet.octopart.com:443/CC0805KRX7R9BB104-Yageo-datasheet-140260305.pdf?src-supplier=SOS+electronic; ComponentLink25Description: https://datasheet.octopart.com:443/CC0805KRX7R9BB104-Yageo-datasheet-140260305.pdf?src-supplier=SOS+electronic; ComponentLink26URL: https://datasheet.octopart.com:443/CC0805KRX7R9BB104-Yageo-datasheet-120101875.pdf?src-supplier=Megastar; ComponentLink26Description: https://datasheet.octopart.com:443/CC0805KRX7R9BB104-Yageo-datasheet-120101875.pdf?src-supplier=Megastar; ComponentLink27URL: https://datasheet.octopart.com:443/CC0805KRX7R9BB104-Yageo-datasheet-8701427.pdf?src-supplier=element14; ComponentLink27Description: https://datasheet.octopart.com:443/CC0805KRX7R9BB104-Yageo-datasheet-8701427.pdf?src-supplier=element14; ComponentLink28URL: https://datasheet.octopart.com:443/CC0805KRX7R9BB104-Yageo-datasheet-5301394.pdf?src-supplier=element14; ComponentLink28Description: https://datasheet.octopart.com:443/CC0805KRX7R9BB104-Yageo-datasheet-5301394.pdf?src-supplier=element14; ComponentLink29URL: https://datasheet.octopart.com:443/CC0805KRX7R9BB104-Yageo-datasheet-17600895.pdf?src-supplier=TME; ComponentLink29Description: https://datasheet.octopart.com:443/CC0805KRX7R9BB104-Yageo-datasheet-17600895.pdf?src-supplier=TME; ComponentLink30URL: https://datasheet.octopart.com:443/CC0805KRX7R9BB104-Yageo-datasheet-118396.pdf?src-supplier=DigiKey; ComponentLink30Description: https://datasheet.octopart.com:443/CC0805KRX7R9BB104-Yageo-datasheet-118396.pdf?src-supplier=DigiKey; ComponentLink31URL: http://sigma.octopart.com:80/conflict_mineral_statement/Yageo-company-3.pdf?src-supplier=Compliance+Statements; ComponentLink31Description: http://sigma.octopart.com:80/conflict_mineral_statement/Yageo-company-3.pdf?src-supplier=Compliance+Statements; ComponentLink32URL: http://sigma.octopart.com:80/rohs_statement/Yageo-company-2.pdf?src-supplier=Compliance+Statements; ComponentLink32Description: http://sigma.octopart.com:80/rohs_statement/Yageo-company-2.pdf?src-supplier=Compliance+Statements; LCSC Part Number: C49678